# EAGLE design PCEmon_PLUS_rev_A (EAGLE 9.4.0)
PC Engine Joypad Breakout Version 1.0
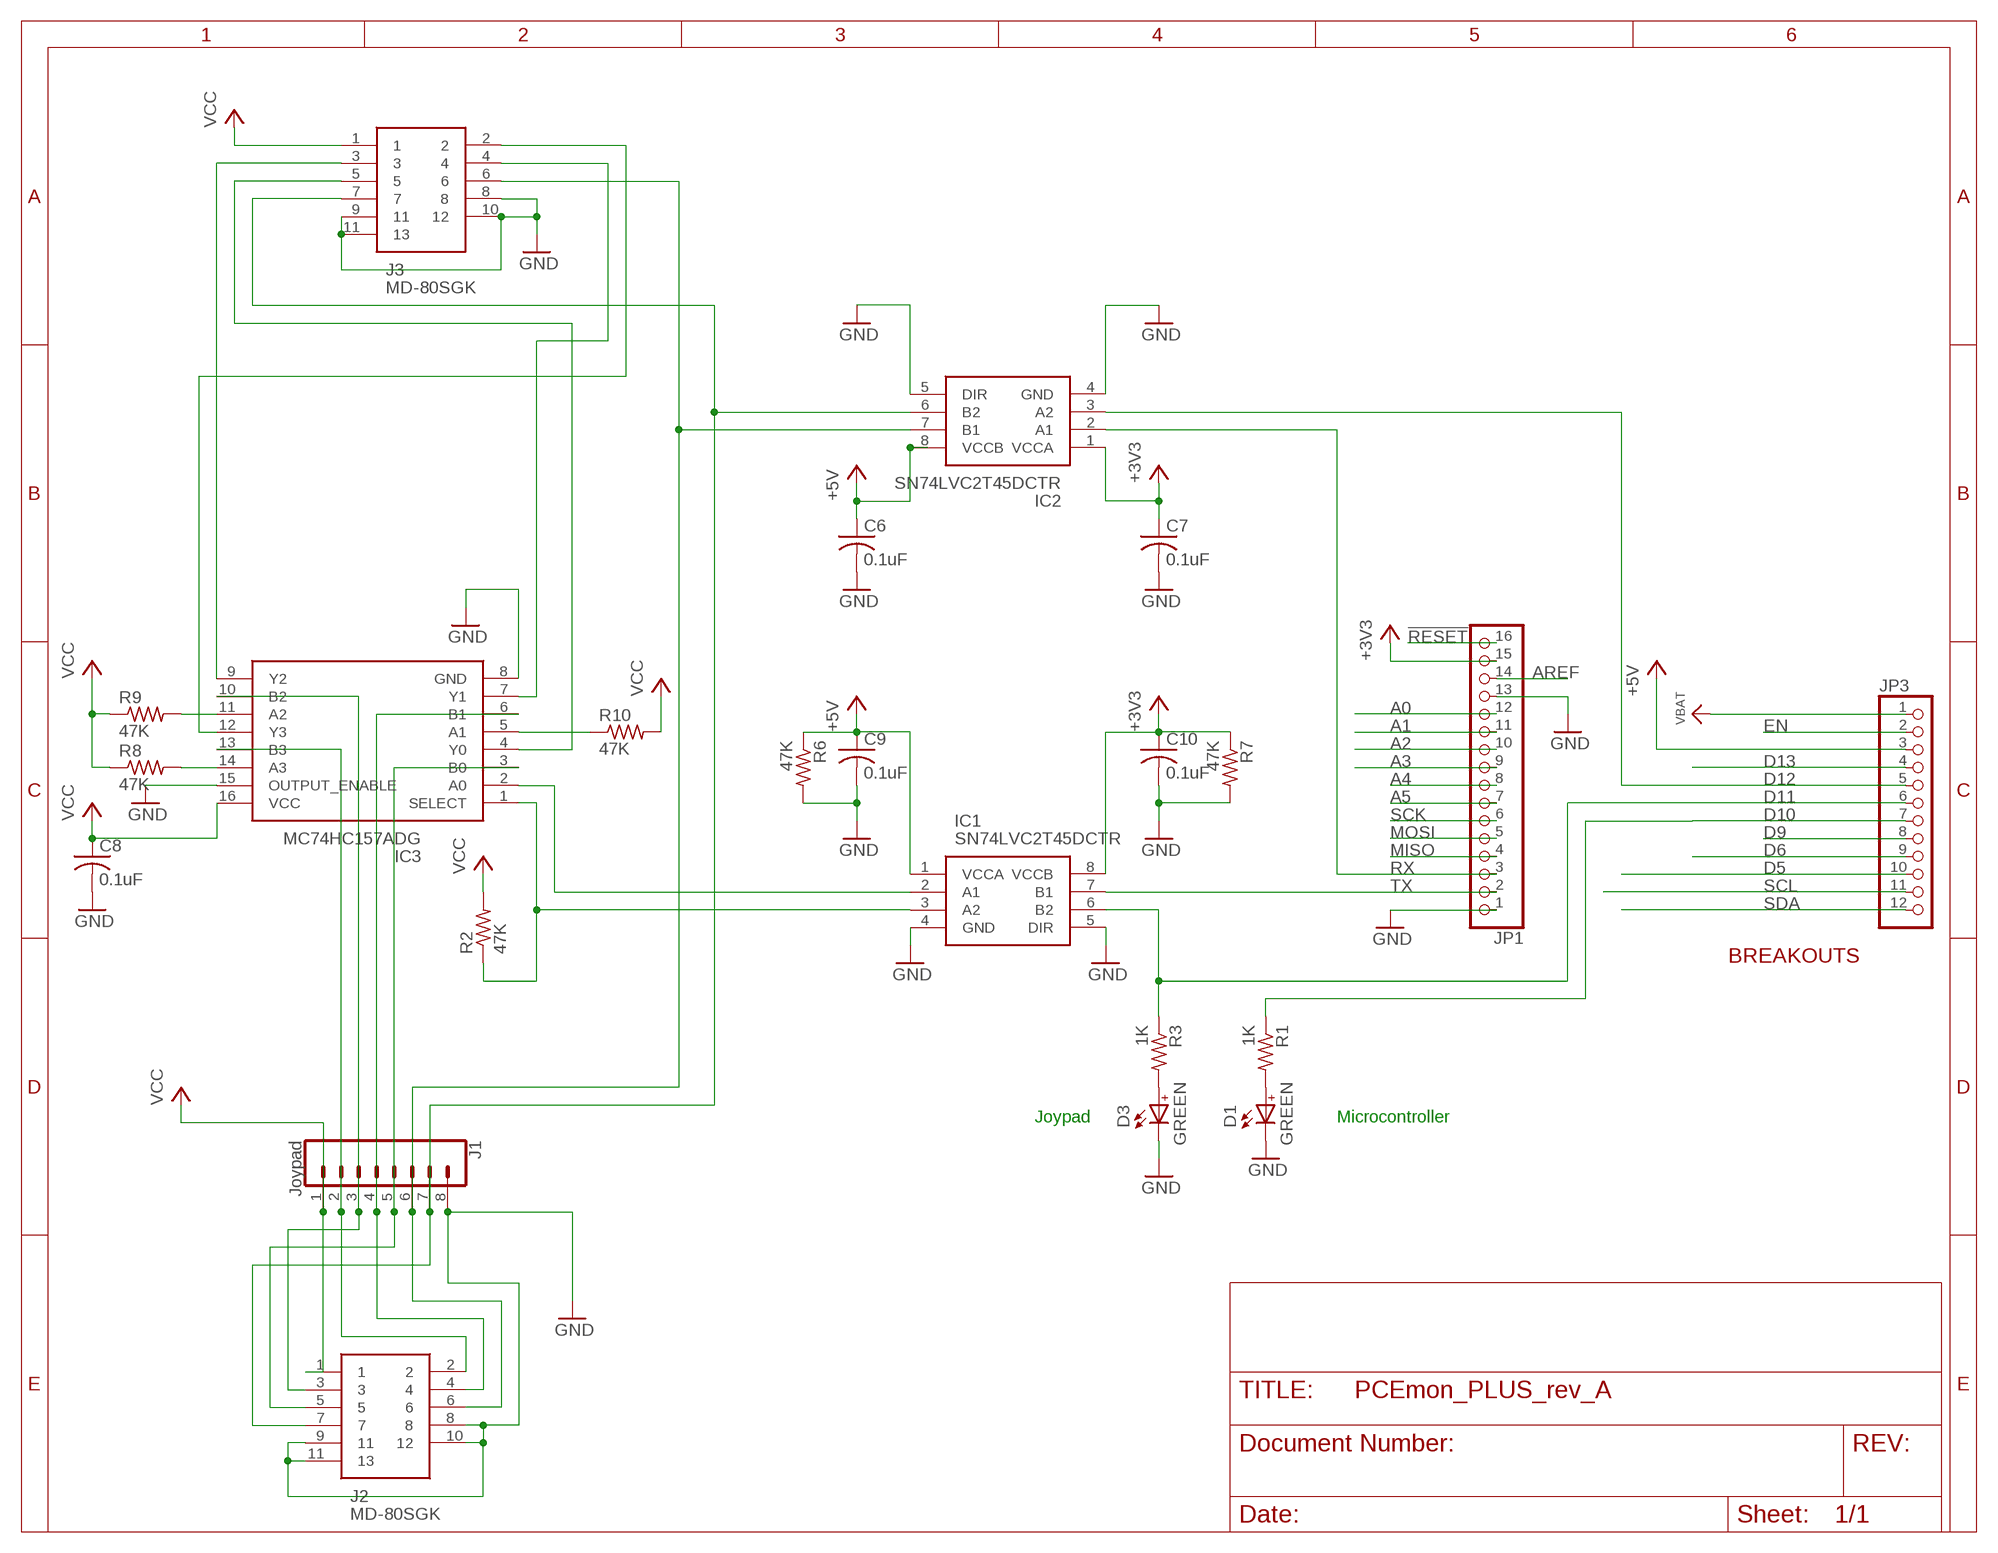
[diagram p0: schematic, sheet 1]

## Parts
C6  0.1uF  C-USC0603  [C0603]
C7  0.1uF  C-USC0603  [C0603]
C8  0.1uF  C-USC0603  [C0603]
C9  0.1uF  C-USC0603  [C0603]
C10  0.1uF  C-USC0603  [C0603]
D1  GREEN  WL-SMCC_0603_R/V/Y_150060RS73220  [WL-SMCC_0603_R/Y/V]
D3  GREEN  WL-SMCC_0603_R/V/Y_150060RS73220  [WL-SMCC_0603_R/Y/V]
IC1  SN74LVC2T45DCTR  [SOP65P400X130-8N]
IC2  SN74LVC2T45DCTR  [SOP65P400X130-8N]
IC3  MC74HC157ADG  [SOIC127P600X175-16N]
J1  Joypad  CONN_08"  [1X08]
J2  MD-80SGK  [MD80SGK]
J3  MD-80SGK  [MD80SGK]
JP1  HEADER-1X16ROUND  [1X16_ROUND]
JP3  HEADER-1X12  [1X12_ROUND]
R1  1K  R-US_R0603  [R0603]
R2  47K  R-US_R0603  [R0603]
R3  1K  R-US_R0603  [R0603]
R6  47K  R-US_R0603  [R0603]
R7  47K  R-US_R0603  [R0603]
R8  47K  R-US_R0603  [R0603]
R9  47K  R-US_R0603  [R0603]
R10  47K  R-US_R0603  [R0603]

## Nets
!RESET: JP1.16
+3V3 [power]: C7.1 C10.1 IC1.8(VCCB) IC2.1(VCCA) JP1.15 R7.1
+5V [power]: C6.1 C9.1 IC1.1(VCCA) IC2.8(VCCB) JP3.3 R6.1
A0: JP1.12
A1: JP1.11
A2: JP1.10
A3: JP1.9
A4: JP1.8
A5: JP1.7
AREF: JP1.14
D5 [signal]: JP3.10
D6 [signal]: JP3.9
D9: JP3.8
D10 [signal]: JP3.7 R1.1
D11 [signal]: IC1.6(B2) JP3.6 R3.1
D12 [signal]: IC2.3(A2) JP3.5
D13 [signal]: JP3.4
EN: JP3.2
GND [power]: C6.2 C7.2 C8.2 C9.2 C10.2 D1.1(C) D3.1(C) IC1.4(GND) IC1.5(DIR) IC2.4(GND) IC2.5(DIR) IC3.8(GND) IC3.15(OUTPUT_ENABLE) J1.8 J2.8 J2.9 J2.10 J2.11 J3.8 J3.9 J3.10 J3.11 JP1.1 JP1.13 R6.2 R7.2
MISO: JP1.4
MOSI: JP1.5
N$1: D3.2(A) R3.2
N$2 [signal]: IC3.10(B2) J1.3 J2.3
N$3 [signal]: IC3.13(B3) J1.2 J2.2
N$4 [signal]: IC3.6(B1) J1.4 J2.4
N$5 [signal]: IC3.3(B0) J1.5 J2.5
N$6 [signal]: IC2.7(B1) J1.6 J2.6 J3.6
N$7 [signal]: IC2.6(B2) J1.7 J2.7 J3.7
N$8: IC3.4(Y0) J3.5
N$9: D1.2(A) R1.2
N$10: IC3.7(Y1) J3.4
N$11: IC3.9(Y2) J3.3
N$12: IC3.14(A3) R8.2
N$13: IC3.11(A2) R9.2
N$14: IC1.3(A2) IC3.1(SELECT) R2.1
N$15: IC1.2(A1) IC3.2(A0)
N$16: IC3.5(A1) R10.1
N$17: IC3.12(Y3) J3.2
RX: IC2.2(A1) JP1.3
SCK: JP1.6
SCL: JP3.11
SDA: JP3.12
TX: IC1.7(B1) JP1.2
VBAT: JP3.1
VCC [power]: C8.1 IC3.16(VCC) J1.1 J2.1 J3.1 R2.2 R8.1 R9.1 R10.2

## Notes on the sheet
- BREAKOUTS
- Joypad | Microcontroller

## Library data of the parts
C6-C10 = resistor:C-US: CAPACITOR, American symbol
D1 D3 = Wurth_Elektronik_Optoelectronics_rev19a:WL-SMCC_0603_R/V/Y: WL-SMCC SMD Mono-color Chip LED Compact Characteristics Compatible to IR reflow soldering Miniaturized color effect Size 0603 Industrial platform – 1.6 x 0.8 mm Ultra thin 0.2 mm PCB based Temperature Tj = 115°C / 125°C Applications Size 0603 Office Automation Home appliances Industrial equipment Industrial switches and button backlighting Dashboards Entertainment consoles Small pixel indoor signs <http://katalog.we-online.de/media/images/v2/Family_WL-SMCC_neu.jpg> Details see: http://katalog.we-online.de/en/led/WL-SMCC?m Created By Yingchun Shan 2018-03-09 2018 (C) Wurth Elektronik
IC1 IC2 = SamacSys_Parts:SN74LVC2T45DCTR: 2-Bit Bus Transceiver, Translation SSOP8 SN74LVC2T45DCTR, Voltage Level Translator, Bus Transceiver LVC, 3-State 1.65 Source: Datasheet <http://www.ti.com/lit/ds/symlink/sn74lvc2t45.pdf>; DESCRIPTION: 2-Bit Bus Transceiver, Translation SSOP8 SN74LVC2T45DCTR, Voltage Level Translator, Bus Transceiver LVC, 3-State 1.65; HEIGHT: 1.3mm; MANUFACTURER_NAME: Texas Instruments; MANUFACTURER_PART_NUMBER: SN74LVC2T45DCTR; MOUSER_PART_NUMBER: 595-SN74LVC2T45DCTR; MOUSER_PRICE-STOCK: https://www.mouser.com/Search/Refine.aspx?Keyword=595-SN74LVC2T45DCTR; RS_PART_NUMBER: 9213022; RS_PRICE-STOCK: http://uk.rs-online.com/web/p/products/9213022
IC3 = PC-Engine:MC74HC157ADG: Source: Datasheet <http://www.onsemi.com/pub/Collateral/MC74HC157A-D.PDF>; ALLIED_NUMBER: 70466365; ALLIED_PRICE-STOCK: http://www.alliedelec.com/on-semiconductor-mc74hc157adg/70466365/; HEIGHT: 1.75mm; MANUFACTURER_NAME: ON Semiconductor; MANUFACTURER_PART_NUMBER: MC74HC157ADG; MOUSER_PART_NUMBER: 863-MC74HC157ADG; MOUSER_PRICE-STOCK: https://www.mouser.com/Search/Refine.aspx?Keyword=863-MC74HC157ADG; RS_PART_NUMBER: 8061422P; RS_PRICE-STOCK: http://uk.rs-online.com/web/p/products/8061422P
J1 = SparkFun-Connectors:CONN_08: Multi connection point. Often used as Generic Header-pin footprint for 0.1 inch spaced/style header connections On any of the 0.1 inch spaced packages, you can populate with these: Break Away Headers - Straight <https://www.sparkfun.com/products/116> (PRT-00116) Break Away Male Headers - Right Angle <https://www.sparkfun.com/products/553> (PRT-00553) Female Headers <https://www.sparkfun.com/products/115> (PRT-00115) Break Away Headers - Machine Pin <https://www.sparkfun.com/products/117> (PRT-00117) Break Away Female Headers - Swiss Machine Pin <https://www.sparkfun.com/products/743> (PRT-00743) Arduino Stackable Header - 8 Pin <https://www.sparkfun.com/products/9279> (PRT-09279) For SCREWTERMINALS and SPRING TERMINALS visit here: Screw Terimnals on SparkFun.com <https://www.sparkfun.com/search/results?term=Screw+Terminals> (5mm/3.5mm/2.54mm spacing) This device is also useful as a general connection point to wire up your design to another part of your project. Our various solder wires solder well into these plated through hole pads. Hook-Up Wire - Assortment (Stranded, 22 AWG) <https://www.sparkfun.com/products/11375> (PRT-11375) Hook-Up Wire - Assortment (Solid Core, 22 AWG) <https://www.sparkfun.com/products/11367> (PRT-11367) View the entire wire category on our website here <https://www.sparkfun.com/categories/141> Special notes: Molex polarized connector foot print use with SKU : PRT-08231 with associated crimp pins and housings. 1MM SMD Version SKU: PRT-10208 NOTES ON THE VARIANTS LOCK and LOCK_LONGPADS... This footprint was designed to help hold the alignment of a through-hole component (i.e. 6-pin header) while soldering it into place. You may notice that each hole has been shifted either up or down by 0.005 of an inch from it's more standard position (which is a perfectly straight line). This slight alteration caused the pins (the squares in the middle) to touch the edges of the holes. Because they are alternating, it causes a "brace" to hold the component in place. 0.005 has proven to be the perfect amount of "off-center" position when using our standard breakaway headers. Although looks a little odd when you look at the bare footprint, once you have a header in there, the alteration is very hard to notice. Also,if you push a header all the way into place, it is covered up entirely on the bottom side.; PROD_ID: CONN-08438
J2 J3 = SamacSys_Parts:MD-80SGK: Circular DIN Connectors mini-DIN, 8P jack, rt, through hole, full shield Source: Datasheet <https://www.cui.com/product/resource/md-sgk-series.pdf>; DESCRIPTION: Circular DIN Connectors mini-DIN, 8P jack, rt, through hole, full shield; HEIGHT: 13mm; MANUFACTURER_NAME: CUI; MANUFACTURER_PART_NUMBER: MD-80SGK; MOUSER_PART_NUMBER: 490-MD-80SGK; MOUSER_PRICE-STOCK: https://www.mouser.com/Search/Refine.aspx?Keyword=490-MD-80SGK
JP1 = microbuilder:HEADER-1X16: PIN HEADER
JP3 = microbuilder:HEADER-1X12
R1-R3 R6-R10 = resistor:R-US_: RESISTOR, American symbol

## Net classes
0 default: width 0.152 mm, drill 0.356 mm, clearance 0.152 mm
1 power: width 0.305 mm, drill 0.356 mm, clearance 0.152 mm
2 signal: width 0.152 mm, drill 0.356 mm, clearance 0.152 mm

## Board
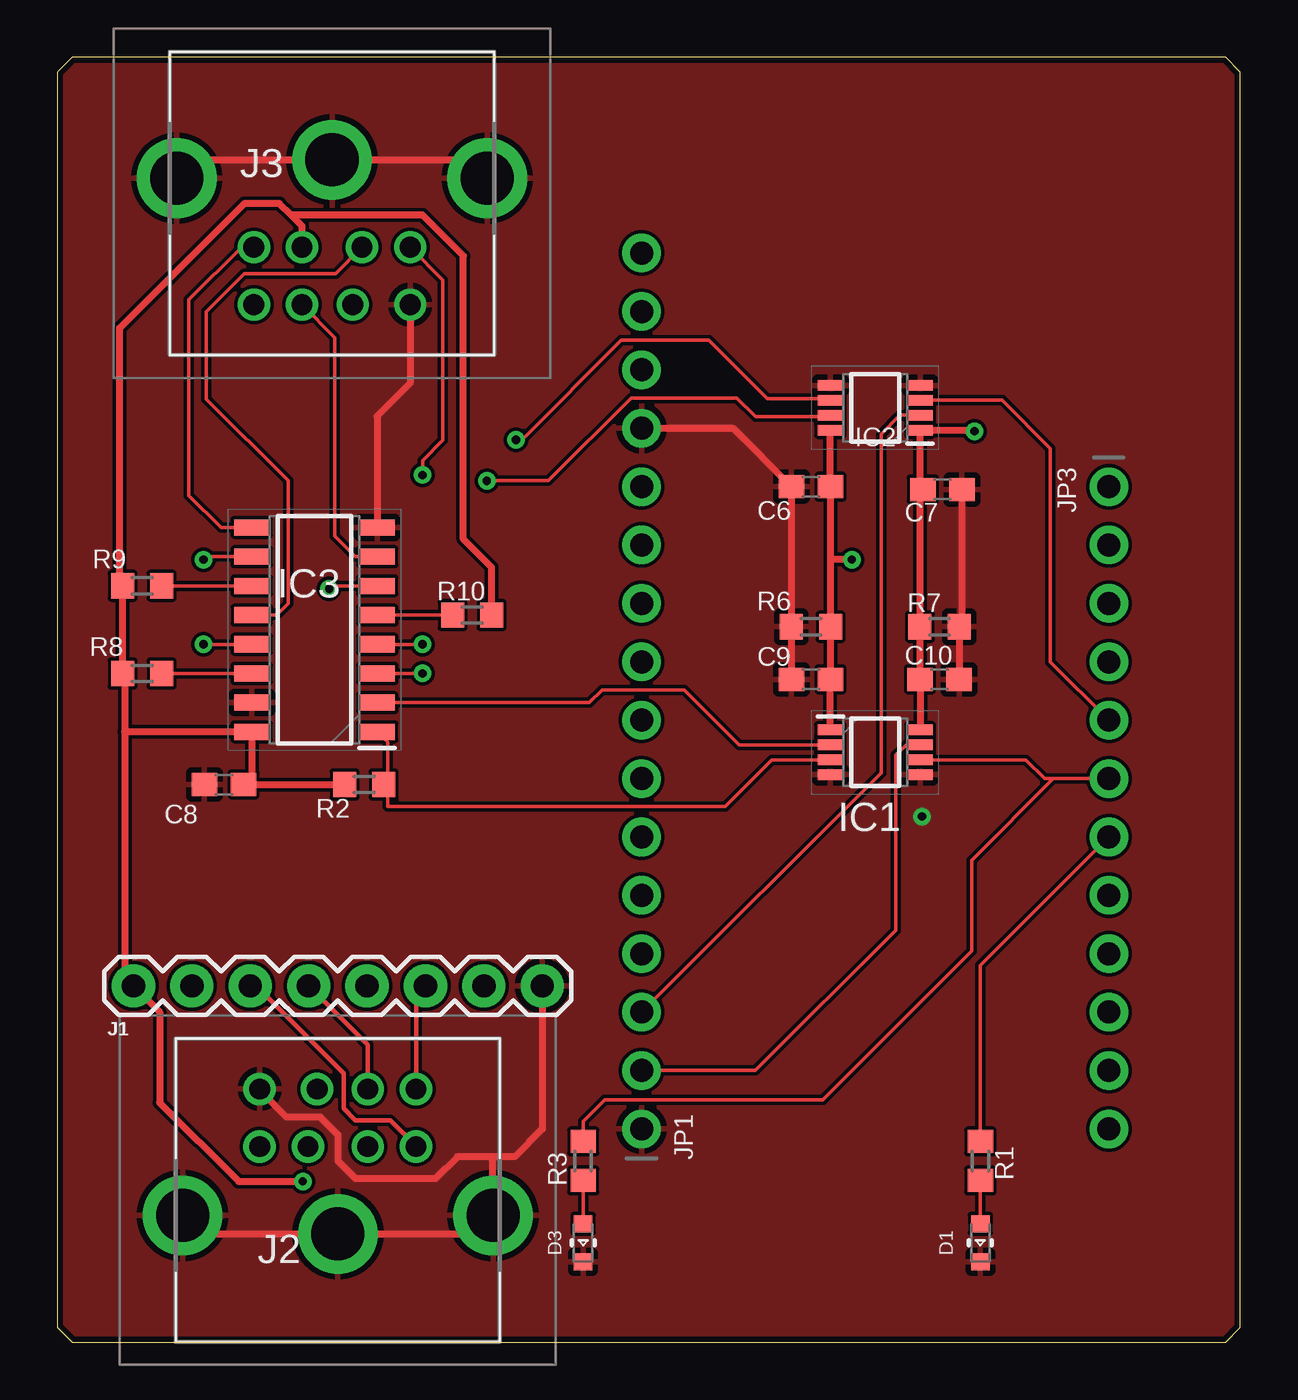
[diagram p1: board, top side]
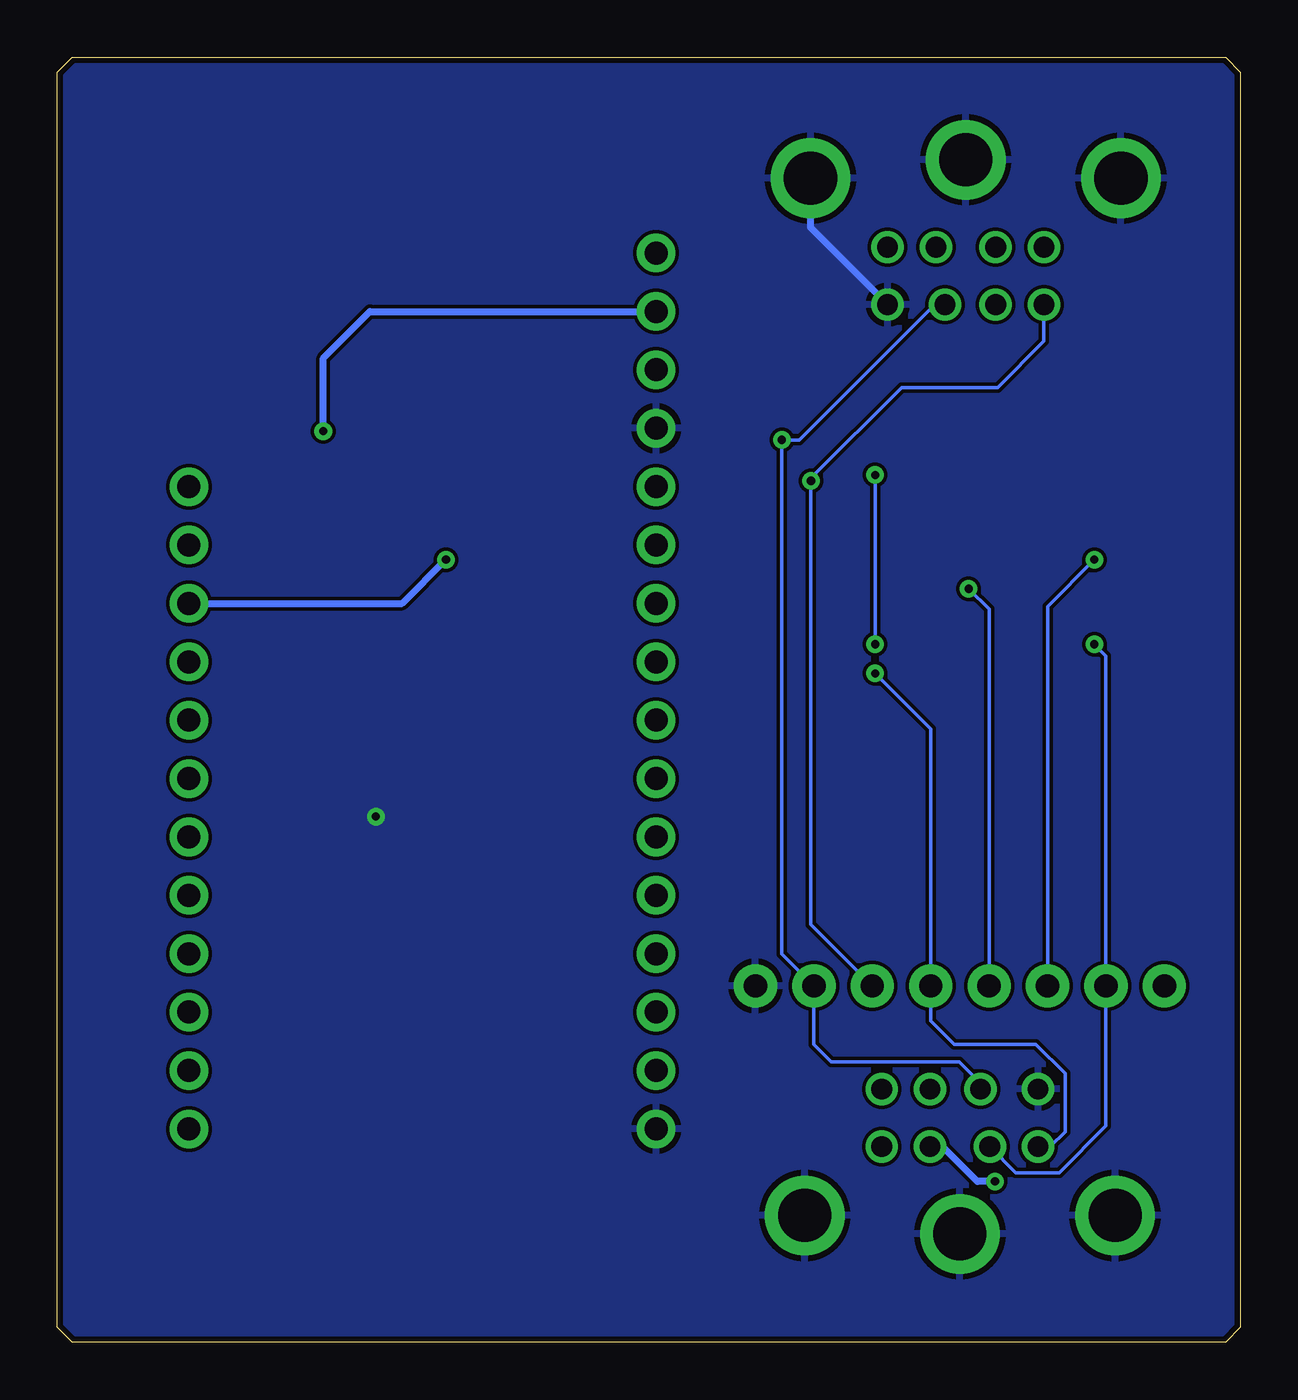
[diagram p2: board, bottom side, seen from below]

Size 51.44 x 55.88 mm. Coordinates in mm from the lower left corner, seen from the top.
Outline: 0,55.24 0,0.64 0.64,0 50.8,0 51.44,0.64 51.44,55.24 50.8,55.88 0.64,55.88 0,55.24
Copper layers (1*16): Top 0.035mm / dielectric 1.5mm / Bottom 0.035mm
Design rules "default *": minimum track width 6mil, minimum drill 0.35mm, track to track 6mil, track to pad 6mil, pad to pad 6mil, via to via 6mil, smd to smd 6mil, copper to edge 10mil, drill to drill 6mil, minimum pad ring 10mil, minimum via ring 8mil, stop-mask expansion 6mil, vias tented up to drill 0mil, thermal gap 10mil

### Footprints (pad centres in the part's own frame; a part is rotated, then mirrored left to right if it is on the bottom)
C0603 = smd 1.1 x 1: 1 -0.85,0; 2 0.85,0
WL-SMCC_0603_R/Y/V = smd 0.75 x 0.8: 1 -0.825,0; 2 0.825,0
SOP65P400X130-8N = smd 1.1 x 0.45: 1 -1.95,0.975; 2 -1.95,0.325; 3 -1.95,-0.325; 4 -1.95,-0.975; 5 1.95,-0.975; 6 1.95,-0.325; 7 1.95,0.325; 8 1.95,0.975
SOIC127P600X175-16N = smd 1.55 x 0.7: 1 -2.725,4.445; 2 -2.725,3.175; 3 -2.725,1.905; 4 -2.725,0.635; 5 -2.725,-0.635; 6 -2.725,-1.905; 7 -2.725,-3.175; 8 -2.725,-4.445; 9 2.725,-4.445; 10 2.725,-3.175; 11 2.725,-1.905; 12 2.725,-0.635; 13 2.725,0.635; 14 2.725,1.905; 15 2.725,3.175; 16 2.725,4.445
1X08 = drill 1.016 pad 1.88: 1 0,0; 2 2.54,0; 3 5.08,0; 4 7.62,0; 5 10.16,0; 6 12.7,0; 7 15.24,0; 8 17.78,0
MD80SGK = drill 0.9 pad 1.4: 1 -1.3,-1.9; 2 1.3,-1.9; 3 -3.4,-1.9; 4 -1.3,-4.4; 5 3.4,-1.9; 6 -3.4,-4.4; 7 0.9,-4.4; 8 3.4,-4.4 | drill 2.309 pad 3.463: 9 0,1.9; 10 -6.75,1.1; 11 6.75,1.1
1X16_ROUND = drill 1 pad 1.676: 1 -19.05,0; 2 -16.51,0; 3 -13.97,0; 4 -11.43,0; 5 -8.89,0; 6 -6.35,0; 7 -3.81,0; 8 -1.27,0; 9 1.27,0; 10 3.81,0; 11 6.35,0; 12 8.89,0; 13 11.43,0; 14 13.97,0; 15 16.51,0; 16 19.05,0
1X12_ROUND = drill 1 pad 1.676: 1 -13.97,0; 2 -11.43,0; 3 -8.89,0; 4 -6.35,0; 5 -3.81,0; 6 -1.27,0; 7 1.27,0; 8 3.81,0; 9 6.35,0; 10 8.89,0; 11 11.43,0; 12 13.97,0
R0603 = smd 1 x 1.1: 1 -0.85,0; 2 0.85,0

### Placement (x,y rotation side)
C6  32.77,37.21 180 top
C7  38.48,37.08 0 top
C8  7.24,24.26 180 top
C9  32.77,28.83 180 top
C10  38.35,28.83 0 top
D1  40.13,4.32 90 top
D3  22.86,4.32 90 top
IC1  35.56,25.65 0 top
IC2  35.56,40.64 180 top
IC3  11.18,30.99 180 top
J1  3.3,15.49 0 top
J2  12.19,6.6 180 top
J3  11.94,49.53 0 top
JP1  25.4,28.32 90 top
JP3  45.72,23.24 270 top
R1  40.13,7.87 270 top
R2  13.34,24.26 180 top
R3  22.86,7.87 270 top
R6  32.77,31.11 180 top
R7  38.35,31.11 0 top
R8  3.68,29.08 0 top
R9  3.68,32.89 0 top
R10  18.03,31.62 0 top

### Tracks (layer width: path | path; a pad name or v marks a point on that pad's centre or on a via)
+3V3  (via drill 0.36)
  Top 0.305: IC1.8 C10.1 R7.1 37.5,36.96 C7.1 37.51,37.2 IC2.1 39.84,39.66 v39.88,39.62
  Bottom 0.305: JP1.15 37.85,44.83 39.88,42.8 v39.88,39.62
+5V  (via drill 0.36)
  Top 0.305: IC1.1 C9.1 R6.1 33.62,34.04 | 33.62,34.04 C6.1 IC2.8 | v34.54,34.04 33.62,34.04
  Bottom 0.305: JP3.3 36.45,32.13 v34.54,34.04
D10
  Top 0.152: JP3.7 40.13,16.38 R1.1
D11
  Top 0.152: IC1.6 42.11,25.33 42.93,24.51 JP3.6 43.31,24.51 39.75,20.95 39.75,17.02 33.27,10.54 23.8,10.54 22.86,9.6 R3.1
D12
  Top 0.152: IC2.3 41.08,40.97 43.18,38.86 43.18,29.59 JP3.5
GND  (via drill 0.36)
  Top 0.305: 18.92,8.06 19.88,8.06 21.08,9.27 J1.8 | 18.92,8.06 17.4,8.06 16.45,7.11 12.95,7.11 12.19,7.87 12.19,9.02 11.43,9.78 9.97,9.78 9.02,10.73 J2.8 | C10.2 R7.2 39.33,31.24 C7.2 | C9.2 R6.2 C6.2 29.38,39.75 JP1.13 | 18.92,8.06 18.92,5.52 J2.10 18.14,4.7 J2.9 6.24,4.7 J2.11 | J3.10 5.99,51.44 J3.9 17.89,51.43 J3.11 | IC3.8 13.9,40.27 15.34,41.71 J3.8
  Bottom 0.305: J3.8 18.69,48.48 J3.11
  other vias: 37.59,22.86
  pour Bottom: -0.38,56.39 52.07,56.39 52.07,-0.38 -0.38,-0.38
  pour Top: -0.76,-0.25 -0.76,56.39 52.07,56.39 52.07,-0.25
N$1
  Top 0.152: R3.2 D3.2
N$2  (via drill 0.36)
  Top 0.152: v6.35,34.04 6.48,34.16 IC3.10
  Top 0.203: J1.3 8.64,15.49 12.45,11.68 12.45,10.16 12.95,9.65 14.48,9.65 15.59,8.54 J2.3
  Bottom 0.152: J1.3 8.38,32 v6.35,34.04
N$3  (via drill 0.36)
  Top 0.152: v6.35,30.35 IC3.13
  Bottom 0.152: J2.2 9.75,7.37 7.87,7.37 5.84,9.4 J1.2 5.84,29.84 v6.35,30.35
N$4  (via drill 0.36)
  Top 0.152: v11.81,32.77 11.94,32.89 IC3.6
  Top 0.203: J2.4 13.49,12.92 J1.4
  Bottom 0.152: J1.4 10.92,31.88 v11.81,32.77
N$5  (via drill 0.36)
  Top 0.152: IC3.3 v15.88,29.08
  Bottom 0.152: J2.5 8.26,8.5 7.62,9.14 7.62,11.68 8.89,12.95 12.45,12.95 13.46,13.97 J1.5 13.46,26.67 v15.88,29.08
N$6  (via drill 0.36)
  Top 0.152: IC2.7 33.55,40.26 30.36,40.26 29.54,41.07 24.94,41.07 21.34,37.47 v18.67,37.47
  Top 0.203: J2.6 15.59,15.08 J1.6
  Bottom 0.152: J1.6 18.67,18.16 v18.67,37.47 18.67,37.59 14.73,41.53 10.54,41.53 8.54,43.53 J3.6
N$7  (via drill 0.36)
  Top 0.152: v19.94,39.24 20.19,39.24 24.52,43.57 28.32,43.57 30.86,41.03 33.54,41.03 IC2.6
  Bottom 0.152: J2.7 11.29,11.26 12.23,12.19 17.78,12.19 18.54,12.95 J1.7 19.94,16.89 v19.94,39.24 19.18,39.24 13.29,45.13 J3.7
N$8  (via drill 0.36)
  Top 0.152: J3.5 16.76,46.2 16.76,39.24 15.88,38.35 v15.88,37.72 | IC3.4 v15.88,30.35
  Bottom 0.152: v15.88,37.72 v15.88,30.35
N$9
  Top 0.152: R1.2 D1.2
N$10
  Top 0.152: J3.4 12.06,43.7 12.06,35.05 12.95,34.16 IC3.7
N$11
  Top 0.152: J3.3 8.01,47.63 5.71,45.34 5.71,36.83 7.11,35.43 IC3.9
N$12
  Top 0.152: R8.2 IC3.14
N$13
  Top 0.152: R9.2 IC3.11
N$14
  Top 0.152: R2.1 14.35,24.26 | IC1.3 31.07,25.33 29.04,23.3 14.35,23.3 14.35,24.26 | IC3.1 14.35,26.09 14.35,24.26
N$15
  Top 0.152: IC1.2 29.65,25.98 27.25,28.37 23.69,28.37 23.13,27.81 IC3.2
N$16
  Top 0.152: IC3.5 R10.1
N$17
  Top 0.152: J3.2 12.09,46.48 8.13,46.48 6.48,44.83 6.48,41.02 10.03,37.47 10.03,32.13 9.53,31.62 IC3.12
RX
  Top 0.152: JP1.3 35.81,24.77 35.81,39.5 36.63,40.31 IC2.2
TX
  Top 0.152: JP1.2 30.35,11.81 36.45,17.91 36.45,25.53 36.9,25.98 IC1.7
VCC  (via drill 0.36)
  Top 0.305: v10.67,6.99 7.87,6.99 4.45,10.41 4.45,14.35 J1.1 2.92,15.88 2.92,26.54 | 2.92,26.54 IC3.16 8.45,24.62 C8.1 R2.2 | 10.16,49.02 10.64,48.54 J3.1 | 10.16,49.02 9.65,49.53 8.13,49.53 2.71,44.11 2.71,33.02 R9.1 R8.1 2.92,29 2.92,26.54 | 10.16,49.02 15.88,49.02 17.65,47.25 17.65,34.92 18.88,33.69 R10.2
  Bottom 0.305: v10.67,6.99 11.44,6.99 12.95,8.5 J2.1

### Text on the board
tValues: PCEmon PLUS, rev. A | (C) 2019 David Shadoff | +5V | D0 | D1 | D2 | D3 | SEL | CLR | GND | JOYPAD | COMPUTER
bValues: JLCJLCJLCJLC